# EAGLE schematic fiberInterface_revC_V3 (EAGLE 9.1.1)
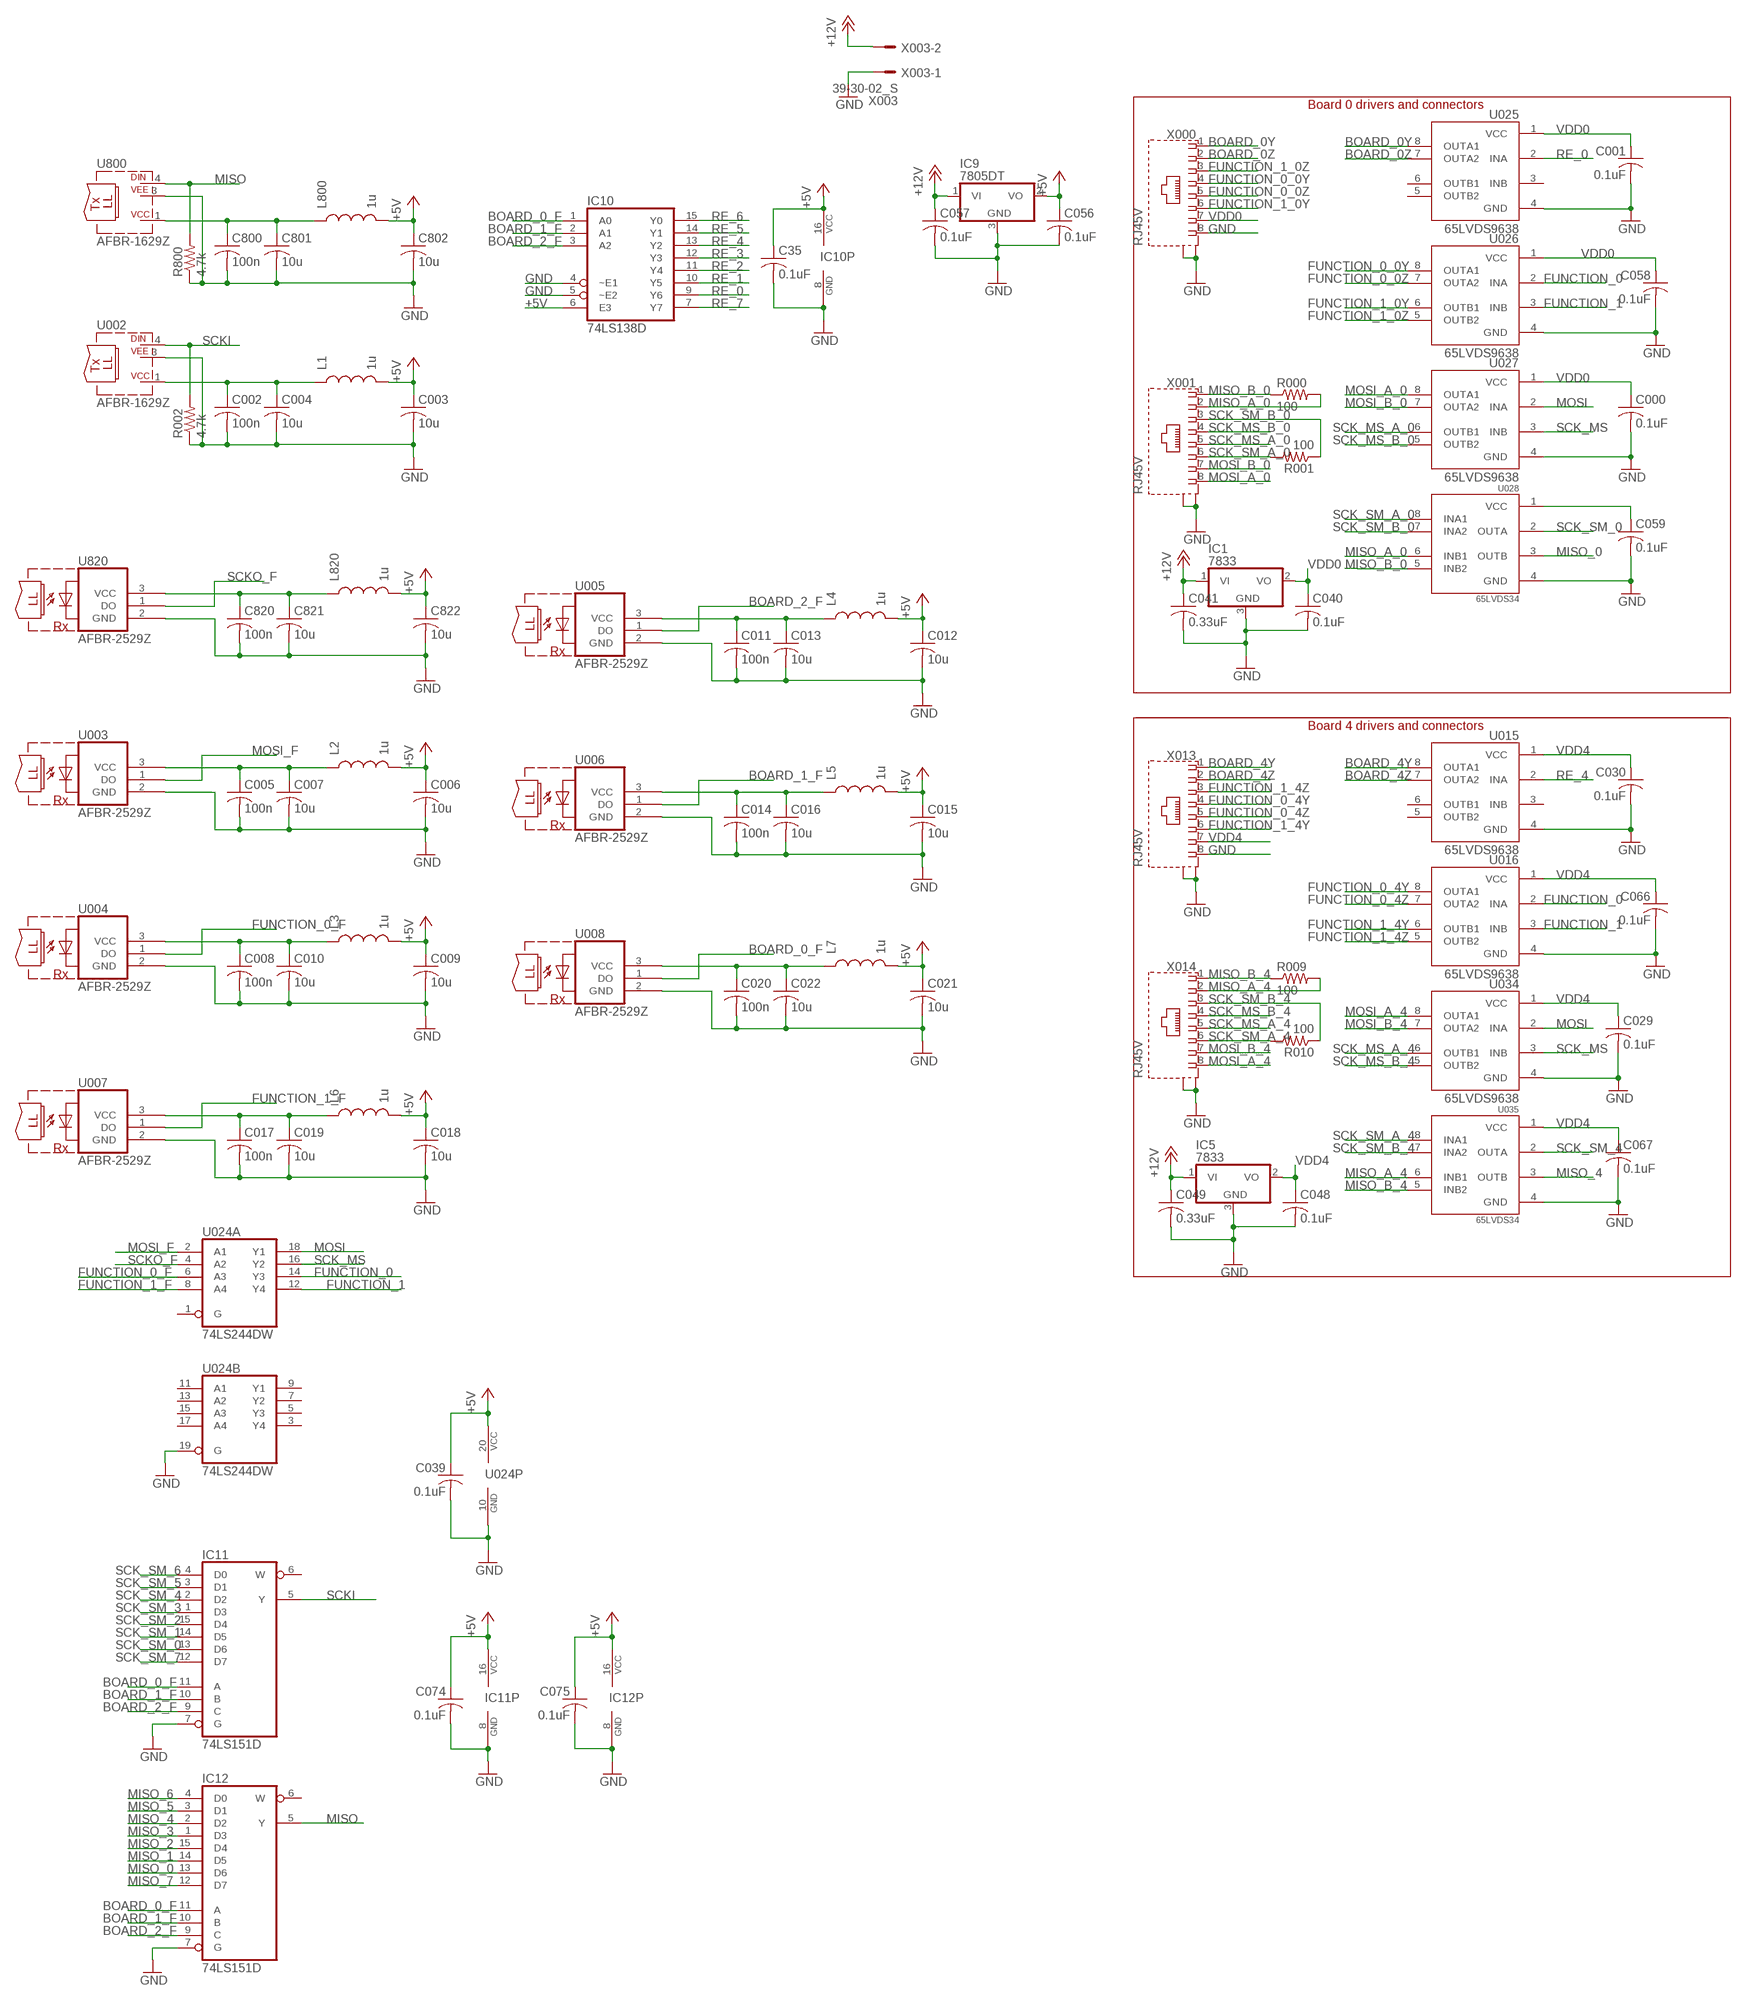
[diagram p0: schematic, sheet 1, part 1 of 2]
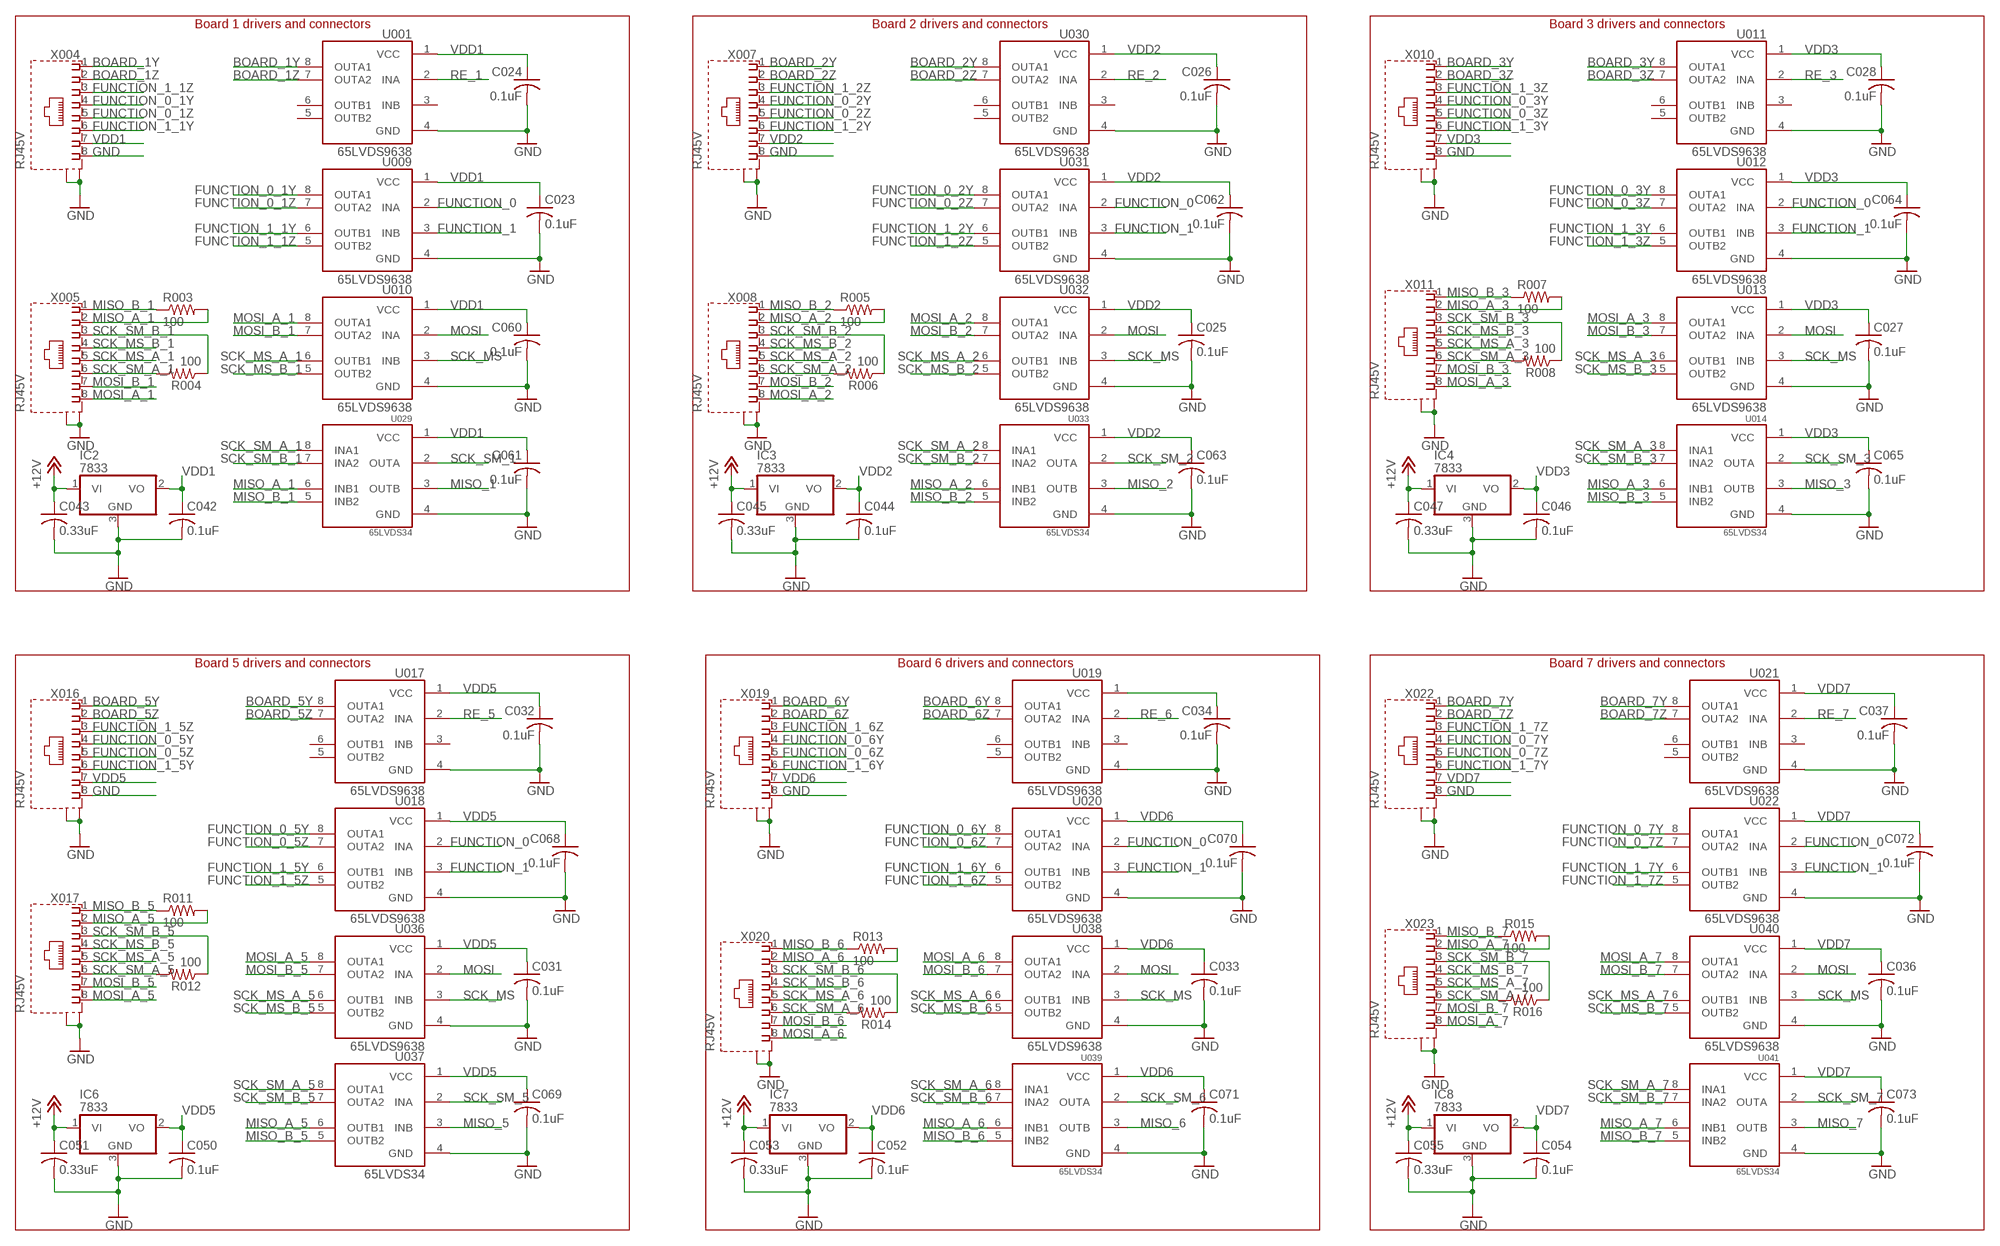
[diagram p1: schematic, sheet 1, part 2 of 2]

## Parts
C000  0.1uF  C-USC0603  [C0603]
C001  0.1uF  C-USC0603  [C0603]
C002  100n  C-USC0805  [C0805]
C003  10u  C-USC1206  [C1206]
C004  10u  C-USC1206  [C1206]
C005  100n  C-USC0805  [C0805]
C006  10u  C-USC1206  [C1206]
C007  10u  C-USC1206  [C1206]
C008  100n  C-USC0805  [C0805]
C009  10u  C-USC1206  [C1206]
C010  10u  C-USC1206  [C1206]
C011  100n  C-USC0805  [C0805]
C012  10u  C-USC1206  [C1206]
C013  10u  C-USC1206  [C1206]
C014  100n  C-USC0805  [C0805]
C015  10u  C-USC1206  [C1206]
C016  10u  C-USC1206  [C1206]
C017  100n  C-USC0805  [C0805]
C018  10u  C-USC1206  [C1206]
C019  10u  C-USC1206  [C1206]
C020  100n  C-USC0805  [C0805]
C021  10u  C-USC1206  [C1206]
C022  10u  C-USC1206  [C1206]
C023  0.1uF  C-USC0603  [C0603]
C024  0.1uF  C-USC0603  [C0603]
C025  0.1uF  C-USC0603  [C0603]
C026  0.1uF  C-USC0603  [C0603]
C027  0.1uF  C-USC0603  [C0603]
C028  0.1uF  C-USC0603  [C0603]
C029  0.1uF  C-USC0603  [C0603]
C030  0.1uF  C-USC0603  [C0603]
C031  0.1uF  C-USC0603  [C0603]
C032  0.1uF  C-USC0603  [C0603]
C033  0.1uF  C-USC0603  [C0603]
C034  0.1uF  C-USC0603  [C0603]
C35  0.1uF  C-USC0603  [C0603]
C036  0.1uF  C-USC0603  [C0603]
C037  0.1uF  C-USC0603  [C0603]
C039  0.1uF  C-USC0603  [C0603]
C040  0.1uF  C-USC0805  [C0805]
C041  0.33uF  C-USC0805  [C0805]
C042  0.1uF  C-USC0805  [C0805]
C043  0.33uF  C-USC0805  [C0805]
C044  0.1uF  C-USC0805  [C0805]
C045  0.33uF  C-USC0805  [C0805]
C046  0.1uF  C-USC0805  [C0805]
C047  0.33uF  C-USC0805  [C0805]
C048  0.1uF  C-USC0805  [C0805]
C049  0.33uF  C-USC0805  [C0805]
C050  0.1uF  C-USC0805  [C0805]
C051  0.33uF  C-USC0805  [C0805]
C052  0.1uF  C-USC0805  [C0805]
C053  0.33uF  C-USC0805  [C0805]
C054  0.1uF  C-USC0805  [C0805]
C055  0.33uF  C-USC0805  [C0805]
C056  0.1uF  C-USC0603  [C0603]
C057  0.1uF  C-USC0603  [C0603]
C058  0.1uF  C-USC0603  [C0603]
C059  0.1uF  C-USC0603  [C0603]
C060  0.1uF  C-USC0603  [C0603]
C061  0.1uF  C-USC0603  [C0603]
C062  0.1uF  C-USC0603  [C0603]
C063  0.1uF  C-USC0603  [C0603]
C064  0.1uF  C-USC0603  [C0603]
C065  0.1uF  C-USC0603  [C0603]
C066  0.1uF  C-USC0603  [C0603]
C067  0.1uF  C-USC0603  [C0603]
C068  0.1uF  C-USC0603  [C0603]
C069  0.1uF  C-USC0603  [C0603]
C070  0.1uF  C-USC0603  [C0603]
C071  0.1uF  C-USC0603  [C0603]
C072  0.1uF  C-USC0603  [C0603]
C073  0.1uF  C-USC0603  [C0603]
C074  0.1uF  C-USC0603  [C0603]
C075  0.1uF  C-USC0603  [C0603]
C800  100n  C-USC0805  [C0805]
C801  10u  C-USC1206  [C1206]
C802  10u  C-USC1206  [C1206]
C820  100n  C-USC0805  [C0805]
C821  10u  C-USC1206  [C1206]
C822  10u  C-USC1206  [C1206]
IC1  7833  7805DT  [TO252]
IC2  7833  7805DT  [TO252]
IC3  7833  7805DT  [TO252]
IC4  7833  7805DT  [TO252]
IC5  7833  7805DT  [TO252]
IC6  7833  7805DT  [TO252]
IC7  7833  7805DT  [TO252]
IC8  7833  7805DT  [TO252]
IC9  7805DT  [TO252]
IC10  74LS138D  74LS238D  [SO16]
IC11  74LS151D  [SO16]
IC12  74LS151D  [SO16]
L1  1u  INDUCTOR0805  [0805]
L2  1u  INDUCTOR0805  [0805]
L3  1u  INDUCTOR0805  [0805]
L4  1u  INDUCTOR0805  [0805]
L5  1u  INDUCTOR0805  [0805]
L6  1u  INDUCTOR0805  [0805]
L7  1u  INDUCTOR0805  [0805]
L800  1u  INDUCTOR0805  [0805]
L820  1u  INDUCTOR0805  [0805]
R000  100  R-US_R0805  [R0805]
R001  100  R-US_R0805  [R0805]
R002  4.7k  R-US_R0805  [R0805]
R003  100  R-US_R0805  [R0805]
R004  100  R-US_R0805  [R0805]
R005  100  R-US_R0805  [R0805]
R006  100  R-US_R0805  [R0805]
R007  100  R-US_R0805  [R0805]
R008  100  R-US_R0805  [R0805]
R009  100  R-US_R0805  [R0805]
R010  100  R-US_R0805  [R0805]
R011  100  R-US_R0805  [R0805]
R012  100  R-US_R0805  [R0805]
R013  100  R-US_R0805  [R0805]
R014  100  R-US_R0805  [R0805]
R015  100  R-US_R0805  [R0805]
R016  100  R-US_R0805  [R0805]
R800  4.7k  R-US_R0805  [R0805]
U001  65LVDS9638  DS9638  [SO08-1]
U002  AFBR-1629Z  AFBR-16XXZ  [HFBR-15X3]
U003  AFBR-2529Z  AFBR-26X4Z  [HFBR-15X3]
U004  AFBR-2529Z  AFBR-26X4Z  [HFBR-15X3]
U005  AFBR-2529Z  AFBR-26X4Z  [HFBR-15X3]
U006  AFBR-2529Z  AFBR-26X4Z  [HFBR-15X3]
U007  AFBR-2529Z  AFBR-26X4Z  [HFBR-15X3]
U008  AFBR-2529Z  AFBR-26X4Z  [HFBR-15X3]
U009  65LVDS9638  DS9638  [SO08-1]
U010  65LVDS9638  DS9638  [SO08-1]
U011  65LVDS9638  DS9638  [SO08-1]
U012  65LVDS9638  DS9638  [SO08-1]
U013  65LVDS9638  DS9638  [SO08-1]
U014  65LVDS34  DS9637A  [SO08-1]
U015  65LVDS9638  DS9638  [SO08-1]
U016  65LVDS9638  DS9638  [SO08-1]
U017  65LVDS9638  DS9638  [SO08-1]
U018  65LVDS9638  DS9638  [SO08-1]
U019  65LVDS9638  DS9638  [SO08-1]
U020  65LVDS9638  DS9638  [SO08-1]
U021  65LVDS9638  DS9638  [SO08-1]
U022  65LVDS9638  DS9638  [SO08-1]
U024  74LS244DW  [SO20W]
U025  65LVDS9638  DS9638  [SO08-1]
U026  65LVDS9638  DS9638  [SO08-1]
U027  65LVDS9638  DS9638  [SO08-1]
U028  65LVDS34  DS9637A  [SO08-1]
U029  65LVDS34  DS9637A  [SO08-1]
U030  65LVDS9638  DS9638  [SO08-1]
U031  65LVDS9638  DS9638  [SO08-1]
U032  65LVDS9638  DS9638  [SO08-1]
U033  65LVDS34  DS9637A  [SO08-1]
U034  65LVDS9638  DS9638  [SO08-1]
U035  65LVDS34  DS9637A  [SO08-1]
U036  65LVDS9638  DS9638  [SO08-1]
U037  65LVDS34  DS9638  [SO08-1]
U038  65LVDS9638  DS9638  [SO08-1]
U039  65LVDS34  DS9637A  [SO08-1]
U040  65LVDS9638  DS9638  [SO08-1]
U041  65LVDS34  DS9637A  [SO08-1]
U800  AFBR-1629Z  AFBR-16XXZ  [HFBR-15X3]
U820  AFBR-2529Z  AFBR-26X4Z  [HFBR-15X3]
X000  RJ45V  [RJ45-VERTICAL]
X001  RJ45V  [RJ45-VERTICAL]
X003  39-30-02_S  [39-30-?02?]
X004  RJ45V  [RJ45-VERTICAL]
X005  RJ45V  [RJ45-VERTICAL]
X007  RJ45V  [RJ45-VERTICAL]
X008  RJ45V  [RJ45-VERTICAL]
X010  RJ45V  [RJ45-VERTICAL]
X011  RJ45V  [RJ45-VERTICAL]
X013  RJ45V  [RJ45-VERTICAL]
X014  RJ45V  [RJ45-VERTICAL]
X016  RJ45V  [RJ45-VERTICAL]
X017  RJ45V  [RJ45-VERTICAL]
X019  RJ45V  [RJ45-VERTICAL]
X020  RJ45V  [RJ45-VERTICAL]
X022  RJ45V  [RJ45-VERTICAL]
X023  RJ45V  [RJ45-VERTICAL]

## Nets
+5V: C003.1 C006.1 C009.1 C012.1 C015.1 C018.1 C021.1 C35.1 C039.1 C056.1 C074.1 C075.1 C802.1 C822.1 IC9.2(VO) IC10.6(E3) IC10.16(VCC) IC11.16(VCC) IC12.16(VCC) L1.2 L2.2 L3.2 L4.2 L5.2 L6.2 L7.2 L800.2 L820.2 U024.20(P:VCC)
+12V: C041.1 C043.1 C045.1 C047.1 C049.1 C051.1 C053.1 C055.1 C057.1 IC1.1(VI) IC2.1(VI) IC3.1(VI) IC4.1(VI) IC5.1(VI) IC6.1(VI) IC7.1(VI) IC8.1(VI) IC9.1(VI) X003.2
BOARD_0_F: IC10.1(A0) IC11.11(A) IC12.11(A) U008.1(DO)
BOARD_0Y: U025.8(OUTA1) X000.1
BOARD_0Z: U025.7(OUTA2) X000.2
BOARD_1_F: IC10.2(A1) IC11.10(B) IC12.10(B) U006.1(DO)
BOARD_1Y: U001.8(OUTA1) X004.1
BOARD_1Z: U001.7(OUTA2) X004.2
BOARD_2_F: IC10.3(A2) IC11.9(C) IC12.9(C) U005.1(DO)
BOARD_2Y: U030.8(OUTA1) X007.1
BOARD_2Z: U030.7(OUTA2) X007.2
BOARD_3Y: U011.8(OUTA1) X010.1
BOARD_3Z: U011.7(OUTA2) X010.2
BOARD_4Y: U015.8(OUTA1) X013.1
BOARD_4Z: U015.7(OUTA2) X013.2
BOARD_5Y: U017.8(OUTA1) X016.1
BOARD_5Z: U017.7(OUTA2) X016.2
BOARD_6Y: U019.8(OUTA1) X019.1
BOARD_6Z: U019.7(OUTA2) X019.2
BOARD_7Y: U021.8(OUTA1) X022.1
BOARD_7Z: U021.7(OUTA2) X022.2
FUNCTION_0: U009.2(INA) U012.2(INA) U016.2(INA) U018.2(INA) U020.2(INA) U022.2(INA) U024.14(A:Y3) U026.2(INA) U031.2(INA)
FUNCTION_0_0Y: U026.8(OUTA1) X000.4
FUNCTION_0_0Z: U026.7(OUTA2) X000.5
FUNCTION_0_1Y: U009.8(OUTA1) X004.4
FUNCTION_0_1Z: U009.7(OUTA2) X004.5
FUNCTION_0_2Y: U031.8(OUTA1) X007.4
FUNCTION_0_2Z: U031.7(OUTA2) X007.5
FUNCTION_0_3Y: U012.8(OUTA1) X010.4
FUNCTION_0_3Z: U012.7(OUTA2) X010.5
FUNCTION_0_4Y: U016.8(OUTA1) X013.4
FUNCTION_0_4Z: U016.7(OUTA2) X013.5
FUNCTION_0_5Y: U018.8(OUTA1) X016.4
FUNCTION_0_5Z: U018.7(OUTA2) X016.5
FUNCTION_0_6Y: U020.8(OUTA1) X019.4
FUNCTION_0_6Z: U020.7(OUTA2) X019.5
FUNCTION_0_7Y: U022.8(OUTA1) X022.4
FUNCTION_0_7Z: U022.7(OUTA2) X022.5
FUNCTION_0_F: U004.1(DO) U024.6(A:A3)
FUNCTION_1: U009.3(INB) U012.3(INB) U016.3(INB) U018.3(INB) U020.3(INB) U022.3(INB) U024.12(A:Y4) U026.3(INB) U031.3(INB)
FUNCTION_1_0Y: U026.6(OUTB1) X000.6
FUNCTION_1_0Z: U026.5(OUTB2) X000.3
FUNCTION_1_1Y: U009.6(OUTB1) X004.6
FUNCTION_1_1Z: U009.5(OUTB2) X004.3
FUNCTION_1_2Y: U031.6(OUTB1) X007.6
FUNCTION_1_2Z: U031.5(OUTB2) X007.3
FUNCTION_1_3Y: U012.6(OUTB1) X010.6
FUNCTION_1_3Z: U012.5(OUTB2) X010.3
FUNCTION_1_4Y: U016.6(OUTB1) X013.6
FUNCTION_1_4Z: U016.5(OUTB2) X013.3
FUNCTION_1_5Y: U018.6(OUTB1) X016.6
FUNCTION_1_5Z: U018.5(OUTB2) X016.3
FUNCTION_1_6Y: U020.6(OUTB1) X019.6
FUNCTION_1_6Z: U020.5(OUTB2) X019.3
FUNCTION_1_7Y: U022.6(OUTB1) X022.6
FUNCTION_1_7Z: U022.5(OUTB2) X022.3
FUNCTION_1_F: U007.1(DO) U024.8(A:A4)
GND: C000.2 C001.2 C002.2 C003.2 C004.2 C005.2 C006.2 C007.2 C008.2 C009.2 C010.2 C011.2 C012.2 C013.2 C014.2 C015.2 C016.2 C017.2 C018.2 C019.2 C020.2 C021.2 C022.2 C023.2 C024.2 C025.2 C026.2 C027.2 C028.2 C029.2 C030.2 C031.2 C032.2 C033.2 C034.2 C35.2 C036.2 C037.2 C039.2 C040.2 C041.2 C042.2 C043.2 C044.2 C045.2 C046.2 C047.2 C048.2 C049.2 C050.2 C051.2 C052.2 C053.2 C054.2 C055.2 C056.2 C057.2 C058.2 C059.2 C060.2 C061.2 C062.2 C063.2 C064.2 C065.2 C066.2 C067.2 C068.2 C069.2 C070.2 C071.2 C072.2 C073.2 C074.2 C075.2 C800.2 C801.2 C802.2 C820.2 C821.2 C822.2 IC1.3(GND) IC2.3(GND) IC3.3(GND) IC4.3(GND) IC5.3(GND) IC6.3(GND) IC7.3(GND) IC8.3(GND) IC9.3(GND) IC10.4(~E1) IC10.5(~E2) IC10.8(GND) IC11.7(G) IC11.8(GND) IC12.7(G) IC12.8(GND) R002.1 R800.1 U001.4(GND) U002.3(VEE) U003.2(GND) U004.2(GND) U005.2(GND) U006.2(GND) U007.2(GND) U008.2(GND) U009.4(GND) U010.4(GND) U011.4(GND) U012.4(GND) U013.4(GND) U014.4(GND) U015.4(GND) U016.4(GND) U017.4(GND) U018.4(GND) U019.4(GND) U020.4(GND) U021.4(GND) U022.4(GND) U024.10(P:GND) U024.19(B:G) U025.4(GND) U026.4(GND) U027.4(GND) U028.4(GND) U029.4(GND) U030.4(GND) U031.4(GND) U032.4(GND) U033.4(GND) U034.4(GND) U035.4(GND) U036.4(GND) U037.4(GND) U038.4(GND) U039.4(GND) U040.4(GND) U041.4(GND) U800.3(VEE) U820.2(GND) X000.8 X000.G1(S) X000.G2(S) X001.G1(S) X001.G2(S) X003.1 X004.8 X004.G1(S) X004.G2(S) X005.G1(S) X005.G2(S) X007.8 X007.G1(S) X007.G2(S) X008.G1(S) X008.G2(S) X010.8 X010.G1(S) X010.G2(S) X011.G1(S) X011.G2(S) X013.8 X013.G1(S) X013.G2(S) X014.G1(S) X014.G2(S) X016.8 X016.G1(S) X016.G2(S) X017.G1(S) X017.G2(S) X019.8 X019.G1(S) X019.G2(S) X020.G1(S) X020.G2(S) X022.8 X022.G1(S) X022.G2(S) X023.G1(S) X023.G2(S)
MISO: IC12.5(Y) R800.2 U800.4(DIN)
MISO_0: IC12.13(D6) U028.3(OUTB)
MISO_1: IC12.14(D5) U029.3(OUTB)
MISO_2: IC12.15(D4) U033.3(OUTB)
MISO_3: IC12.1(D3) U014.3(OUTB)
MISO_4: IC12.2(D2) U035.3(OUTB)
MISO_5: IC12.3(D1) U037.3(INB)
MISO_6: IC12.4(D0) U039.3(OUTB)
MISO_7: IC12.12(D7) U041.3(OUTB)
MISO_A_0: R000.2 U028.6(INB1) X001.2
MISO_A_1: R003.2 U029.6(INB1) X005.2
MISO_A_2: R005.2 U033.6(INB1) X008.2
MISO_A_3: R007.2 U014.6(INB1) X011.2
MISO_A_4: R009.2 U035.6(INB1) X014.2
MISO_A_5: R011.2 U037.6(OUTB1) X017.2
MISO_A_6: R013.2 U039.6(INB1) X020.2
MISO_A_7: R015.2 U041.6(INB1) X023.2
MISO_B_0: R000.1 U028.5(INB2) X001.1
MISO_B_1: R003.1 U029.5(INB2) X005.1
MISO_B_2: R005.1 U033.5(INB2) X008.1
MISO_B_3: R007.1 U014.5(INB2) X011.1
MISO_B_4: R009.1 U035.5(INB2) X014.1
MISO_B_5: R011.1 U037.5(OUTB2) X017.1
MISO_B_6: R013.1 U039.5(INB2) X020.1
MISO_B_7: R015.1 U041.5(INB2) X023.1
MOSI: U010.2(INA) U013.2(INA) U024.18(A:Y1) U027.2(INA) U032.2(INA) U034.2(INA) U036.2(INA) U038.2(INA) U040.2(INA)
MOSI_A_0: U027.8(OUTA1) X001.8
MOSI_A_1: U010.8(OUTA1) X005.8
MOSI_A_2: U032.8(OUTA1) X008.8
MOSI_A_3: U013.8(OUTA1) X011.8
MOSI_A_4: U034.8(OUTA1) X014.8
MOSI_A_5: U036.8(OUTA1) X017.8
MOSI_A_6: U038.8(OUTA1) X020.8
MOSI_A_7: U040.8(OUTA1) X023.8
MOSI_B_0: U027.7(OUTA2) X001.7
MOSI_B_1: U010.7(OUTA2) X005.7
MOSI_B_2: U032.7(OUTA2) X008.7
MOSI_B_3: U013.7(OUTA2) X011.7
MOSI_B_4: U034.7(OUTA2) X014.7
MOSI_B_5: U036.7(OUTA2) X017.7
MOSI_B_6: U038.7(OUTA2) X020.7
MOSI_B_7: U040.7(OUTA2) X023.7
MOSI_F: U003.1(DO) U024.2(A:A1)
N$1: C800.1 C801.1 L800.1 U800.1(VCC)
N$2: C002.1 C004.1 L1.1 U002.1(VCC)
N$3: C005.1 C007.1 L2.1 U003.3(VCC)
N$4: C008.1 C010.1 L3.1 U004.3(VCC)
N$5: C820.1 C821.1 L820.1 U820.3(VCC)
N$6: C011.1 C013.1 L4.1 U005.3(VCC)
N$7: C014.1 C016.1 L5.1 U006.3(VCC)
N$8: C017.1 C019.1 L6.1 U007.3(VCC)
N$9: C020.1 C022.1 L7.1 U008.3(VCC)
RE_0: IC10.9(Y6) U025.2(INA)
RE_1: IC10.10(Y5) U001.2(INA)
RE_2: IC10.11(Y4) U030.2(INA)
RE_3: IC10.12(Y3) U011.2(INA)
RE_4: IC10.13(Y2) U015.2(INA)
RE_5: IC10.14(Y1) U017.2(INA)
RE_6: IC10.15(Y0) U019.2(INA)
RE_7: IC10.7(Y7) U021.2(INA)
SCK_MS: U010.3(INB) U013.3(INB) U024.16(A:Y2) U027.3(INB) U032.3(INB) U034.3(INB) U036.3(INB) U038.3(INB) U040.3(INB)
SCK_MS_A_0: U027.6(OUTB1) X001.5
SCK_MS_A_1: U010.6(OUTB1) X005.5
SCK_MS_A_2: U032.6(OUTB1) X008.5
SCK_MS_A_3: U013.6(OUTB1) X011.5
SCK_MS_A_4: U034.6(OUTB1) X014.5
SCK_MS_A_5: U036.6(OUTB1) X017.5
SCK_MS_A_6: U038.6(OUTB1) X020.5
SCK_MS_A_7: U040.6(OUTB1) X023.5
SCK_MS_B_0: U027.5(OUTB2) X001.4
SCK_MS_B_1: U010.5(OUTB2) X005.4
SCK_MS_B_2: U032.5(OUTB2) X008.4
SCK_MS_B_3: U013.5(OUTB2) X011.4
SCK_MS_B_4: U034.5(OUTB2) X014.4
SCK_MS_B_5: U036.5(OUTB2) X017.4
SCK_MS_B_6: U038.5(OUTB2) X020.4
SCK_MS_B_7: U040.5(OUTB2) X023.4
SCK_SM_0: IC11.13(D6) U028.2(OUTA)
SCK_SM_1: IC11.14(D5) U029.2(OUTA)
SCK_SM_2: IC11.15(D4) U033.2(OUTA)
SCK_SM_3: IC11.1(D3) U014.2(OUTA)
SCK_SM_4: IC11.2(D2) U035.2(OUTA)
SCK_SM_5: IC11.3(D1) U037.2(INA)
SCK_SM_6: IC11.4(D0) U039.2(OUTA)
SCK_SM_7: IC11.12(D7) U041.2(OUTA)
SCK_SM_A_0: R001.2 U028.8(INA1) X001.6
SCK_SM_A_1: R004.2 U029.8(INA1) X005.6
SCK_SM_A_2: R006.2 U033.8(INA1) X008.6
SCK_SM_A_3: R008.2 U014.8(INA1) X011.6
SCK_SM_A_4: R010.2 U035.8(INA1) X014.6
SCK_SM_A_5: R012.2 U037.8(OUTA1) X017.6
SCK_SM_A_6: R014.2 U039.8(INA1) X020.6
SCK_SM_A_7: R016.2 U041.8(INA1) X023.6
SCK_SM_B_0: R001.1 U028.7(INA2) X001.3
SCK_SM_B_1: R004.1 U029.7(INA2) X005.3
SCK_SM_B_2: R006.1 U033.7(INA2) X008.3
SCK_SM_B_3: R008.1 U014.7(INA2) X011.3
SCK_SM_B_4: R010.1 U035.7(INA2) X014.3
SCK_SM_B_5: R012.1 U037.7(OUTA2) X017.3
SCK_SM_B_6: R014.1 U039.7(INA2) X020.3
SCK_SM_B_7: R016.1 U041.7(INA2) X023.3
SCKI: IC11.5(Y) R002.2 U002.4(DIN)
SCKO_F: U024.4(A:A2) U820.1(DO)
VDD0: C000.1 C001.1 C040.1 C058.1 C059.1 IC1.2(VO) U025.1(VCC) U026.1(VCC) U027.1(VCC) U028.1(VCC) X000.7
VDD1: C023.1 C024.1 C042.1 C060.1 C061.1 IC2.2(VO) U001.1(VCC) U009.1(VCC) U010.1(VCC) U029.1(VCC) X004.7
VDD2: C025.1 C026.1 C044.1 C062.1 C063.1 IC3.2(VO) U030.1(VCC) U031.1(VCC) U032.1(VCC) U033.1(VCC) X007.7
VDD3: C027.1 C028.1 C046.1 C064.1 C065.1 IC4.2(VO) U011.1(VCC) U012.1(VCC) U013.1(VCC) U014.1(VCC) X010.7
VDD4: C029.1 C030.1 C048.1 C066.1 C067.1 IC5.2(VO) U015.1(VCC) U016.1(VCC) U034.1(VCC) U035.1(VCC) X013.7
VDD5: C031.1 C032.1 C050.1 C068.1 C069.1 IC6.2(VO) U017.1(VCC) U018.1(VCC) U036.1(VCC) U037.1(VCC) X016.7
VDD6: C033.1 C034.1 C052.1 C070.1 C071.1 IC7.2(VO) U019.1(VCC) U020.1(VCC) U038.1(VCC) U039.1(VCC) X019.7
VDD7: C036.1 C037.1 C054.1 C072.1 C073.1 IC8.2(VO) U021.1(VCC) U022.1(VCC) U040.1(VCC) U041.1(VCC) X022.7
Unconnected: IC11.6(W) IC12.6(W) U001.3(INB) U001.5(OUTB2) U001.6(OUTB1) U011.3(INB) U011.5(OUTB2) U011.6(OUTB1) U015.3(INB) U015.5(OUTB2) U015.6(OUTB1) U017.3(INB) U017.5(OUTB2) U017.6(OUTB1) U019.3(INB) U019.5(OUTB2) U019.6(OUTB1) U021.3(INB) U021.5(OUTB2) U021.6(OUTB1) U024.1(A:G) U024.3(B:Y4) U024.5(B:Y3) U024.7(B:Y2) U024.9(B:Y1) U024.11(B:A1) U024.13(B:A2) U024.15(B:A3) U024.17(B:A4) U025.3(INB) U025.5(OUTB2) U025.6(OUTB1) U030.3(INB) U030.5(OUTB2) U030.6(OUTB1)

## Notes on the sheet
- Board 0 drivers and connectors | Board 1 drivers and connectors | Board 2 drivers and connectors | Board 3 drivers and connectors
- Board 4 drivers and connectors | Board 5 drivers and connectors | Board 6 drivers and connectors | Board 7 drivers and connectors

## Library data of the parts
C000 C001-C009 C010-C034 C35 C036 C037 C039-C075 C800-C802 C820-C822 = rcl:C-US: CAPACITOR, American symbol; SPICEPREFIX: C
IC1-IC9 = linear:78*: Positive VOLTAGE REGULATOR Source: http://cache.national.com/ds/LM/LM78L05.pdf http://www.fairchildsemi.com/ds/LM/LM7805.pdf
IC10 = 74xx-us:74*238: 3-line to 8-line DECODER/DEMULTIPLEXER
IC11 IC12 = 74xx-us:74*151: Data SELECTOR/MULTIPLEXER
L1-L7 L800 L820 = SparkFun-Passives:INDUCTOR: Inductors Basic Inductor/Choke - 0603 and 1206. Footprints are not proven and vary greatly between part numbers. SRN6045- 33uH, 20% 1.4A SDR0403-560KL - 56uH, 10%, 500mA RMS/740mA peak
R000 R001-R009 R010-R016 R800 = rcl:R-US_: RESISTOR, American symbol; SPICEPREFIX: R
U001 U009 U010-U013 U015-U022 U025-U027 U030-U032 U034 U036-U038 U040 = 74xx-us:DS9638
U002 U800 = fiber-optic-hp:AFBR-16XXZ
U003-U008 U820 = fiber-optic-hp:AFBR-26X4Z
U014 U028 U029 U033 U035 U039 U041 = 74xx-us:DS9637A
U024 = 74xx-us:74*244: Octal BUFFER and LINE DRIVER, 3-state
X000 X001 X004 X005 X007 X008 X010 X011 X013 X014 X016 X017 X019 X020 X022 X023 = con-tycoelectronics:RJ45V
X003 = con-molex-mini-fit:39-30-?02?_S: HEADER